# Altium schematic sheet RK3566_MIPI_HDMI.SchDoc
size A3; SheetNumber: 19; SheetTotal: 20
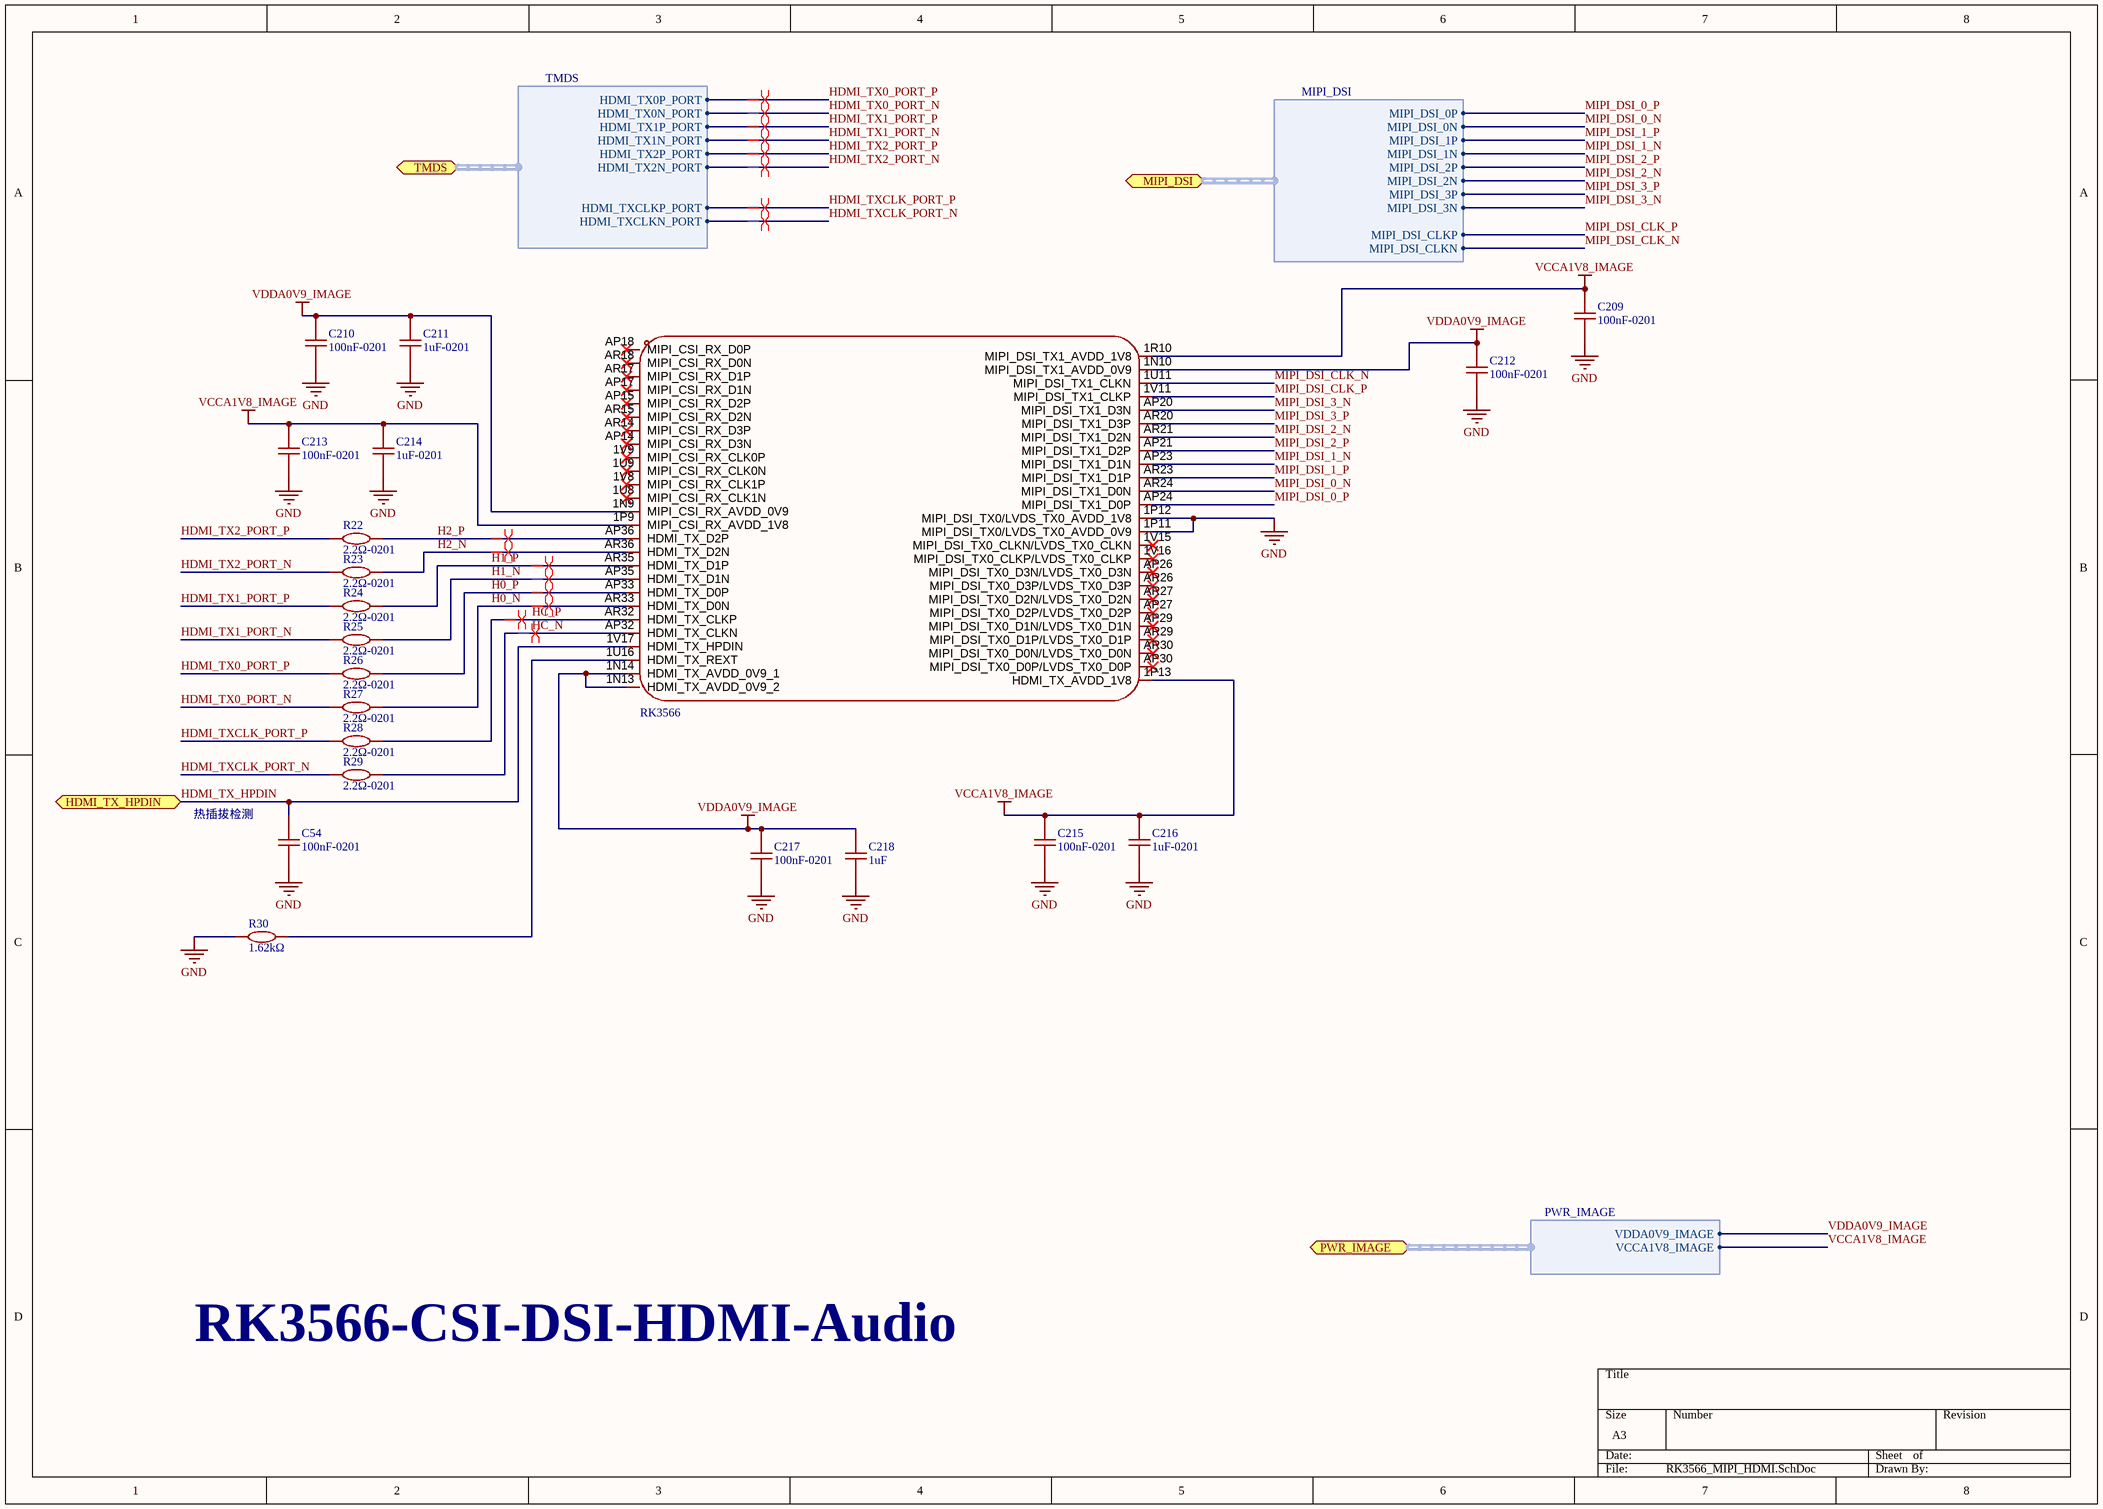
[diagram p0: RK3566_MIPI_HDMI.SchDoc]

## Parts
C54  100nF-0201  [C0201]
C209  100nF-0201  [C0201]
C210  100nF-0201  [C0201]
C211  1uF-0201  [C0201]
C212  100nF-0201  [C0201]
C213  100nF-0201  [C0201]
C214  1uF-0201  [C0201]
C215  100nF-0201  [C0201]
C216  1uF-0201  [C0201]
C217  100nF-0201  [C0201]
C218  1uF  [C0402]
R22  2.2Ω-0201  [R0201]
R23  2.2Ω-0201  [R0201]
R24  2.2Ω-0201  [R0201]
R25  2.2Ω-0201  [R0201]
R26  2.2Ω-0201  [R0201]
R27  2.2Ω-0201  [R0201]
R28  2.2Ω-0201  [R0201]
R29  2.2Ω-0201  [R0201]
R30  1.62kΩ  [R0402]
U2  RK3566  [BGA-565_L15.5-W14.4-P0.40_RK3566_1]  (part G of 8)

## Ports
HDMI_TX_HPDIN (bidir, see RK3566[2A], HDMI[8A], RK3566[3A]), MIPI_DSI (bidir, harness MIPI_DSI, see RK3566[2B], MIPI_DSI_TP[6A], RK3566[3B]), PWR_IMAGE (bidir, harness PWR_IMAGE, see RK3566[2B], POWER[1C], POWER_PMIC[3B], RK3566[3C], RK3566_USB_GPIO[1B]), TMDS (bidir, harness TMDS, see RK3566[2A], HDMI[2D], RK3566[3A])

## Harnesses
MIPI_DSI: MIPI_DSI_0P, MIPI_DSI_0N, MIPI_DSI_1P, MIPI_DSI_1N, MIPI_DSI_2P, MIPI_DSI_2N, MIPI_DSI_CLKP, MIPI_DSI_3P, MIPI_DSI_3N, MIPI_DSI_CLKN
PWR_IMAGE: VDDA0V9_IMAGE, VCCA1V8_IMAGE
TMDS: HDMI_TX0P_PORT, HDMI_TX0N_PORT, HDMI_TX1P_PORT, HDMI_TX1N_PORT, HDMI_TX2P_PORT, HDMI_TX2N_PORT, HDMI_TXCLKP_PORT, HDMI_TXCLKN_PORT

## Nets
GND: C54.1 C209.1 C210.1 C211.1 C212.1 C213.1 C214.1 C215.1 C216.1 C217.1 C218.1 R30.1 U2.1P11(MIPI_DSI_TX0/LVDS_TX0_AVDD_0V9) U2.1P12(MIPI_DSI_TX0/LVDS_TX0_AVDD_1V8)
VCCA1V8_IMAGE: C209.2 C213.2 C214.2 C215.2 C216.2 U2.1P9(MIPI_CSI_RX_AVDD_1V8) U2.1P13(HDMI_TX_AVDD_1V8) U2.1R10(MIPI_DSI_TX1_AVDD_1V8) ; port PWR_IMAGE.VCCA1V8_IMAGE
VDDA0V9_IMAGE: C210.2 C211.2 C212.2 C217.2 C218.2 U2.1N9(MIPI_CSI_RX_AVDD_0V9) U2.1N10(MIPI_DSI_TX1_AVDD_0V9) U2.1N13(HDMI_TX_AVDD_0V9_2) U2.1N14(HDMI_TX_AVDD_0V9_1) ; port PWR_IMAGE.VDDA0V9_IMAGE
H0_N: R27.2 U2.AR33(HDMI_TX_D0N)
H0_P: R26.2 U2.AP33(HDMI_TX_D0P)
H1_N: R25.2 U2.AP35(HDMI_TX_D1N)
H1_P: R24.2 U2.AR35(HDMI_TX_D1P)
H2_N: R23.2 U2.AR36(HDMI_TX_D2N)
H2_P: R22.2 U2.AP36(HDMI_TX_D2P)
HC_N: R29.2 U2.AP32(HDMI_TX_CLKN)
HC_P: R28.2 U2.AR32(HDMI_TX_CLKP)
HDMI_TX0_PORT_N: R27.1 ; port TMDS.HDMI_TX0N_PORT
HDMI_TX0_PORT_P: R26.1 ; port TMDS.HDMI_TX0P_PORT
HDMI_TX1_PORT_N: R25.1 ; port TMDS.HDMI_TX1N_PORT
HDMI_TX1_PORT_P: R24.1 ; port TMDS.HDMI_TX1P_PORT
HDMI_TX2_PORT_N: R23.1 ; port TMDS.HDMI_TX2N_PORT
HDMI_TX2_PORT_P: R22.1 ; port TMDS.HDMI_TX2P_PORT
HDMI_TX_HPDIN: C54.2 U2.1V17(HDMI_TX_HPDIN) ; port HDMI_TX_HPDIN
HDMI_TXCLK_PORT_N: R29.1 ; port TMDS.HDMI_TXCLKN_PORT
HDMI_TXCLK_PORT_P: R28.1 ; port TMDS.HDMI_TXCLKP_PORT
MIPI_DSI_0_N: U2.AR24(MIPI_DSI_TX1_D0N) ; port MIPI_DSI.MIPI_DSI_0N
MIPI_DSI_0_P: U2.AP24(MIPI_DSI_TX1_D0P) ; port MIPI_DSI.MIPI_DSI_0P
MIPI_DSI_1_N: U2.AP23(MIPI_DSI_TX1_D1N) ; port MIPI_DSI.MIPI_DSI_1N
MIPI_DSI_1_P: U2.AR23(MIPI_DSI_TX1_D1P) ; port MIPI_DSI.MIPI_DSI_1P
MIPI_DSI_2_N: U2.AR21(MIPI_DSI_TX1_D2N) ; port MIPI_DSI.MIPI_DSI_2N
MIPI_DSI_2_P: U2.AP21(MIPI_DSI_TX1_D2P) ; port MIPI_DSI.MIPI_DSI_2P
MIPI_DSI_3_N: U2.AP20(MIPI_DSI_TX1_D3N) ; port MIPI_DSI.MIPI_DSI_3N
MIPI_DSI_3_P: U2.AR20(MIPI_DSI_TX1_D3P) ; port MIPI_DSI.MIPI_DSI_3P
MIPI_DSI_CLK_N: U2.1U11(MIPI_DSI_TX1_CLKN) ; port MIPI_DSI.MIPI_DSI_CLKN
MIPI_DSI_CLK_P: U2.1V11(MIPI_DSI_TX1_CLKP) ; port MIPI_DSI.MIPI_DSI_CLKP
NetR30_2: R30.2 U2.1U16(HDMI_TX_REXT)

Not connected (* = marked no-connect by the designer): U2 1U8(MIPI_CSI_RX_CLK1N)* 1U9(MIPI_CSI_RX_CLK0N)* 1V8(MIPI_CSI_RX_CLK1P)* 1V9(MIPI_CSI_RX_CLK0P)* 1V15(MIPI_DSI_TX0_CLKN/LVDS_TX0_CLKN)* 1V16(MIPI_DSI_TX0_CLKP/LVDS_TX0_CLKP)* AP14(MIPI_CSI_RX_D3N)* AP15(MIPI_CSI_RX_D2P)* AP17(MIPI_CSI_RX_D1N)* AP18(MIPI_CSI_RX_D0P)* AP26(MIPI_DSI_TX0_D3N/LVDS_TX0_D3N)* AP27(MIPI_DSI_TX0_D2P/LVDS_TX0_D2P)* AP29(MIPI_DSI_TX0_D1N/LVDS_TX0_D1N)* AP30(MIPI_DSI_TX0_D0P/LVDS_TX0_D0P)* AR14(MIPI_CSI_RX_D3P)* AR15(MIPI_CSI_RX_D2N)* AR17(MIPI_CSI_RX_D1P)* AR18(MIPI_CSI_RX_D0N)* AR26(MIPI_DSI_TX0_D3P/LVDS_TX0_D3P)* AR27(MIPI_DSI_TX0_D2N/LVDS_TX0_D2N)* AR29(MIPI_DSI_TX0_D1P/LVDS_TX0_D1P)* AR30(MIPI_DSI_TX0_D0N/LVDS_TX0_D0N)*

## Layout directives
differential pair: H0_N, H0_P, H1_N, H1_P, H2_N, H2_P, HC_N, HC_P, HDMI_TX0_PORT_N, HDMI_TX0_PORT_P, HDMI_TX1_PORT_N, HDMI_TX1_PORT_P, HDMI_TX2_PORT_N, HDMI_TX2_PORT_P, HDMI_TXCLK_PORT_N, HDMI_TXCLK_PORT_P

## Notes on the sheet
- 热插拔检测
- RK3566-CSI-DSI-HDMI-Audio

## Library data of the parts
C54 C209 C210 C212 C213 C215 C217 = 100nF-0201: CL03A104KO3NNNC
C211 C214 C216 = 1uF-0201: CL03A104KO3NNNC
C218 = 1uF: 50V 1uF X5R ±10% 0402 Ceramic Capacitors ROHS
R22-R29 = 2.2Ω-0201: 小尺寸、重量轻。降低组装成本,与贴片机匹配。适用于波峰焊和回流焊
R30 = 1.62kΩ: 特性：无卤环氧树脂。符合RoHS标准。无铅端接产品符合RoHS要求。RoHS豁免电极、电阻元件和玻璃中含有的铅玻璃。减少对环境有害的废物。高组件和设备可靠性。应用：所有通用应用
U2 = RK3566: BGA-565(15.5x14.4); Symbol: RK3566